# Altium schematic sheet MCU.SchDoc
size A3
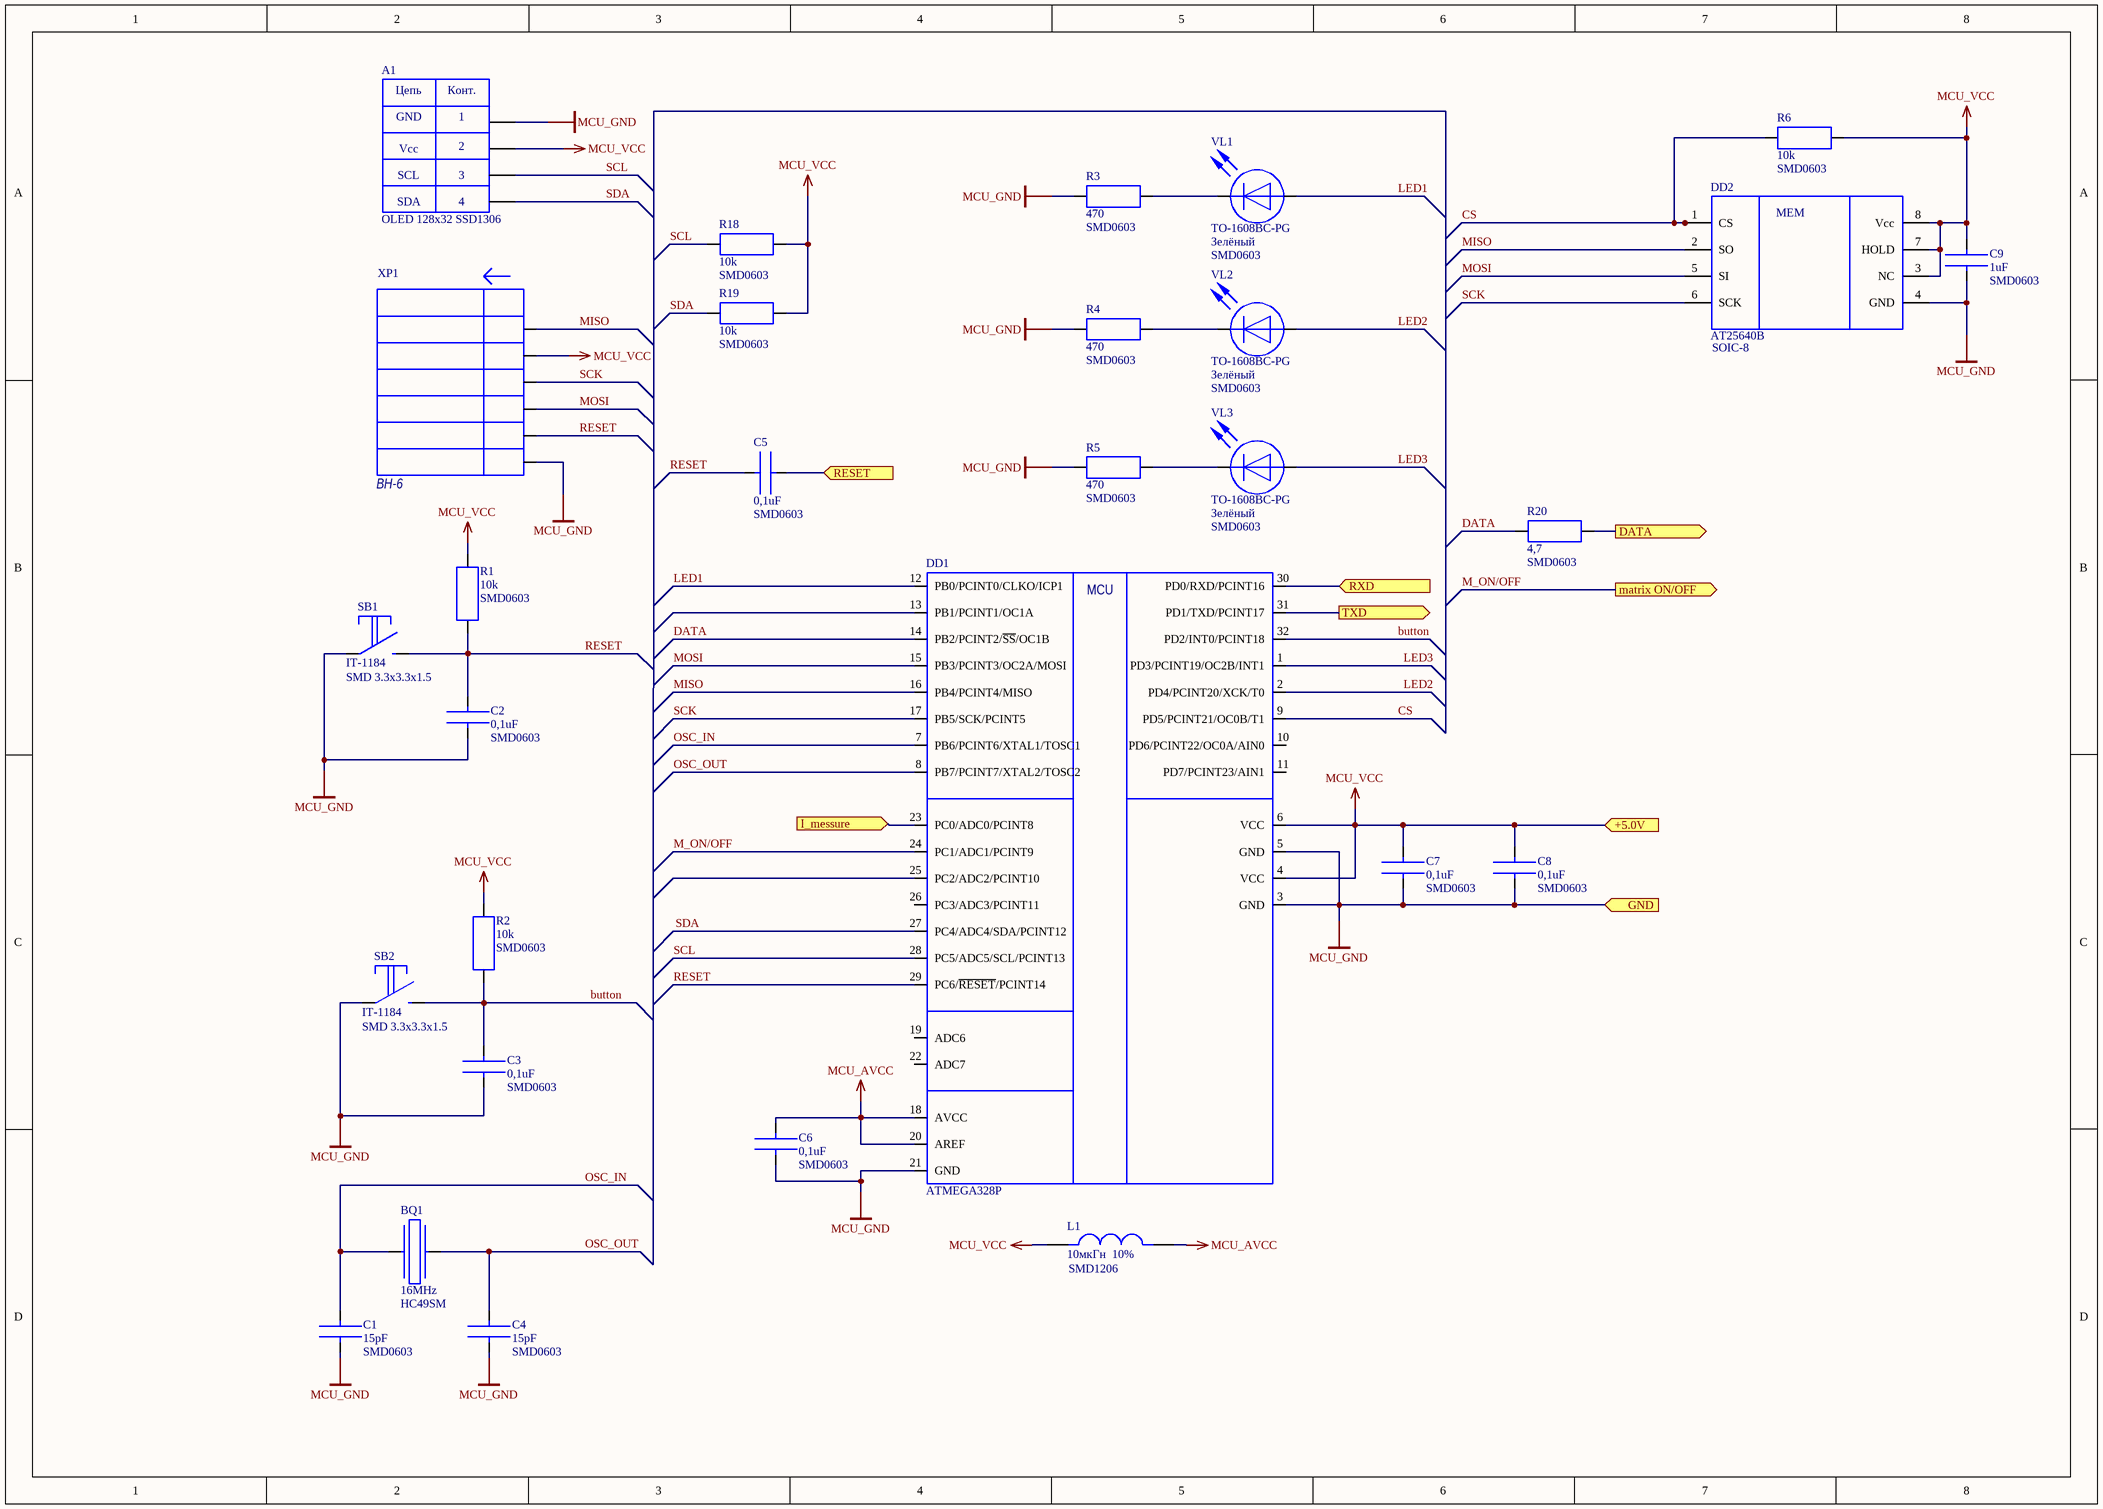
[diagram p0: MCU.SchDoc]

## Parts
A1  OLED 128x32 SSD1306  [OLED 128x32]
BQ1  16МHz  Package: HC49SM  [BQ_HC49SM]
C1  15pF  Package: SMD0603  [SMD0603(1005)]
C2  0,1uF  Package: SMD0603  [SMD0603(1005)]
C3  0,1uF  Package: SMD0603  [SMD0603(1005)]
C4  15pF  Package: SMD0603  [SMD0603(1005)]
C5  0,1uF  Package: SMD0603  [SMD0603(1005)]
C6  0,1uF  Package: SMD0603  [SMD0603(1005)]
C7  0,1uF  Package: SMD0603  [SMD0603(1005)]
C8  0,1uF  Package: SMD0603  [SMD0603(1005)]
C9  1uF  Package: SMD0603  [SMD0603(1005)]
DD1  ATMEGA328P  [TQFP-32]
DD2  AT25640B  Package: SOIC-8  [SOIC8]
L1  10мкГн  10%  Package: SMD1206  [SMD1206(3216)]
R1  10k  Package: SMD0603  [SMD0603(1005)]
R2  10k  Package: SMD0603  [SMD0603(1005)]
R3  470  Package: SMD0603  [SMD0603(1005)]
R4  470  Package: SMD0603  [SMD0603(1005)]
R5  470  Package: SMD0603  [SMD0603(1005)]
R6  10k  Package: SMD0603  [SMD0603(1005)]
R18  10k  Package: SMD0603  [SMD0603(1005)]
R19  10k  Package: SMD0603  [SMD0603(1005)]
R20  4,7  Package: SMD0603  [SMD0603(1005)]
SB1  IT-1184  Package: SMD 3.3x3.3x1.5  [IT-1184]
SB2  IT-1184  Package: SMD 3.3x3.3x1.5  [IT-1184]
VL1  TO-1608BC-PG  Light: Зелёный  Package: SMD0603  [LED_SMD0603(1005)]
VL2  TO-1608BC-PG  Light: Зелёный  Package: SMD0603  [LED_SMD0603(1005)]
VL3  TO-1608BC-PG  Light: Зелёный  Package: SMD0603  [LED_SMD0603(1005)]
XP1  BH-6  [IDC-6 (2.54)]

## Ports
+5.0V (in), DATA (out), GND (in), I_messure (in), matrix ON/OFF (out), RESET (in), RXD (in), TXD (out)

## Nets
MCU_AVCC: C6.1 DD1.18(AVCC) DD1.20(AREF) L1.2(IN1)
MCU_GND: A1.1(+5) C1.1 C2.2 C3.2 C4.1 C6.2 C7.2 C8.1 C9.2 DD1.3(GND) DD1.5(GND) DD1.21(GND) DD2.4(GND) R3.2 R4.2 R5.2 SB1.1 SB2.1 XP1.6 ; port GND
MCU_VCC: A1.2(DM-) C7.1 C8.2 C9.1 DD1.4(VCC) DD1.6(VCC) DD2.3(NC) DD2.7(HOLD) DD2.8(Vcc) L1.1(IN1) R1.2 R2.2 R6.2 R18.1 R19.1 XP1.2 ; port +5.0V
button: C3.1 DD1.32(PD2/INT0/PCINT18) R2.1 SB2.2
CS: DD1.9(PD5/PCINT21/OC0B/T1) DD2.1(CS) R6.1
DATA: DD1.14(PB2/PCINT2/~{SS}/OC1B) R20.1
DATA: R20.2 ; port DATA  [a separate net that carries the same name]
I_messure: DD1.23(PC0/ADC0/PCINT8) ; port I_messure
LED1: DD1.12(PB0/PCINT0/CLKO/ICP1) VL1.1
LED2: DD1.2(PD4/PCINT20/XCK/T0) VL2.1
LED3: DD1.1(PD3/PCINT19/OC2B/INT1) VL3.1
M_ON/OFF: DD1.24(PC1/ADC1/PCINT9) ; port matrix ON/OFF
MISO: DD1.16(PB4/PCINT4/MISO) DD2.2(SO) XP1.1
MOSI: DD1.15(PB3/PCINT3/OC2A/MOSI) DD2.5(SI) XP1.4
OSC_IN: BQ1.1 C1.2 DD1.7(PB6/PCINT6/XTAL1/TOSC1)
OSC_OUT: BQ1.2 C4.2 DD1.8(PB7/PCINT7/XTAL2/TOSC2)
RESET: C2.1 C5.1 DD1.29(PC6/~{RESET}/PCINT14) R1.1 SB1.2 XP1.5
RESET: C5.2 ; port RESET  [a separate net that carries the same name]
RXD: DD1.30(PD0/RXD/PCINT16) ; port RXD
SCK: DD1.17(PB5/SCK/PCINT5) DD2.6(SCK) XP1.3
SCL: A1.3(DM-) DD1.28(PC5/ADC5/SCL/PCINT13) R18.2
SDA: A1.4(DM-) DD1.27(PC4/ADC4/SDA/PCINT12) R19.2
TXD: DD1.31(PD1/TXD/PCINT17) ; port TXD
NetR3_1: R3.1 VL1.2
NetR4_1: R4.1 VL2.2
NetR5_1: R5.1 VL3.2

Not connected (* = marked no-connect by the designer): DD1 10(PD6/PCINT22/OC0A/AIN0) 11(PD7/PCINT23/AIN1) 13(PB1/PCINT1/OC1A) 19(ADC6) 22(ADC7) 25(PC2/ADC2/PCINT10) 26(PC3/ADC3/PCINT11)

## Notes on the sheet
- Title
- Size:
- Date:
- A3
- Number:
- Time:
- Revision:
- Sheet
- of
- File:
- (in symbol ATMEGA168V-10AU) MCU
- (in symbol OLED) Цепь; Конт.; GND; Vcc; SCL; SDA
- (in symbol Микросхема AT25640B) MEM

## Library data of the parts
A1 = OLED: ValueBOM: Дисплей OLED-дисплей 0.91-дюймовый, белый, ЖК дисплей 128 * 32, на SSD1306, модуль для Arduino, интерфейс I2C IIC; Type: A; Value: OLED 128x32 SSD1306
BQ1 = BQ_HC49SM: ValueBOM: Кварцевый резонатор 16МГц HC49S; Type: BQ; Value: 16МHz
C1 C4 = CER_CUP_0603: Type: C; ValueBOM: Конденсатор керамический 15пФ SMD 0603 1%; Value: 15pF
C2 C3 C5-C8 = CER_CUP_0603: Type: C; ValueBOM: Конденсатор керамический 0,1мкФ SMD 0603 1%; Value: 0,1uF
C9 = CER_CUP_0603: Type: C; ValueBOM: Конденсатор керамический 1мкФ SMD 0603 1%; Value: 1uF
DD1 = ATMEGA168V-10AU: Microcontroller; Vendor: Atmel; ValueBOM: Микроконтроллер ATMEGA328P; GlobalLink: ATMEGA168V-10AU; Type: DD; Value: ATMEGA328P; Vendor P/N: ATMEGA168V-10AU; Package: TQFP-32; Package Description: JEDEC reference MS-026, Variation ABA
DD2 = Микросхема AT25640B: ValueBOM: Микросхема EEPROM AT25640B; Value: AT25640B; Type: DD
L1 = L1: ValueBOM: Индуктивность 10 мкГн, SMD1206, 10%; Type: L; Value: 10мкГн  10%
R1 R2 R6 R18 R19 = R_0603: ValueBOM: Резистор 10кОм SMD 0603 1%; Type: R; Value: 10k
R3-R5 = R_0603: ValueBOM: Резистор 470 Ом SMD 0603 1%; Type: R; Value: 470
R20 = R_0603: ValueBOM: Резистор 4,7Ом SMD 0603 1%; Type: R; Value: 4,7
SB1 SB2 = Кнопка тактовая (универсальная): ValueBOM: Кнопка тактовая IT1184; Type: SB; Value: IT-1184
VL1-VL3 = LED_0603: ValueBOM: Светодиод зелёный TO-1608BC-PG SMD0603; Type: VL; Value: TO-1608BC-PG
XP1 = ISP_HEADER: ValueBOM: Разъем BH-6 вилка 6 контактов (2х3), на плату, шаг 2.54мм; GlobalLink: ISP_HEADER; Type: XP; Value: BH-6; Package: DIL-6